# Altium schematic sheet MainSchematic.2.SchDoc
size OrCAD B; SheetNumber: 1; SheetTotal: 3
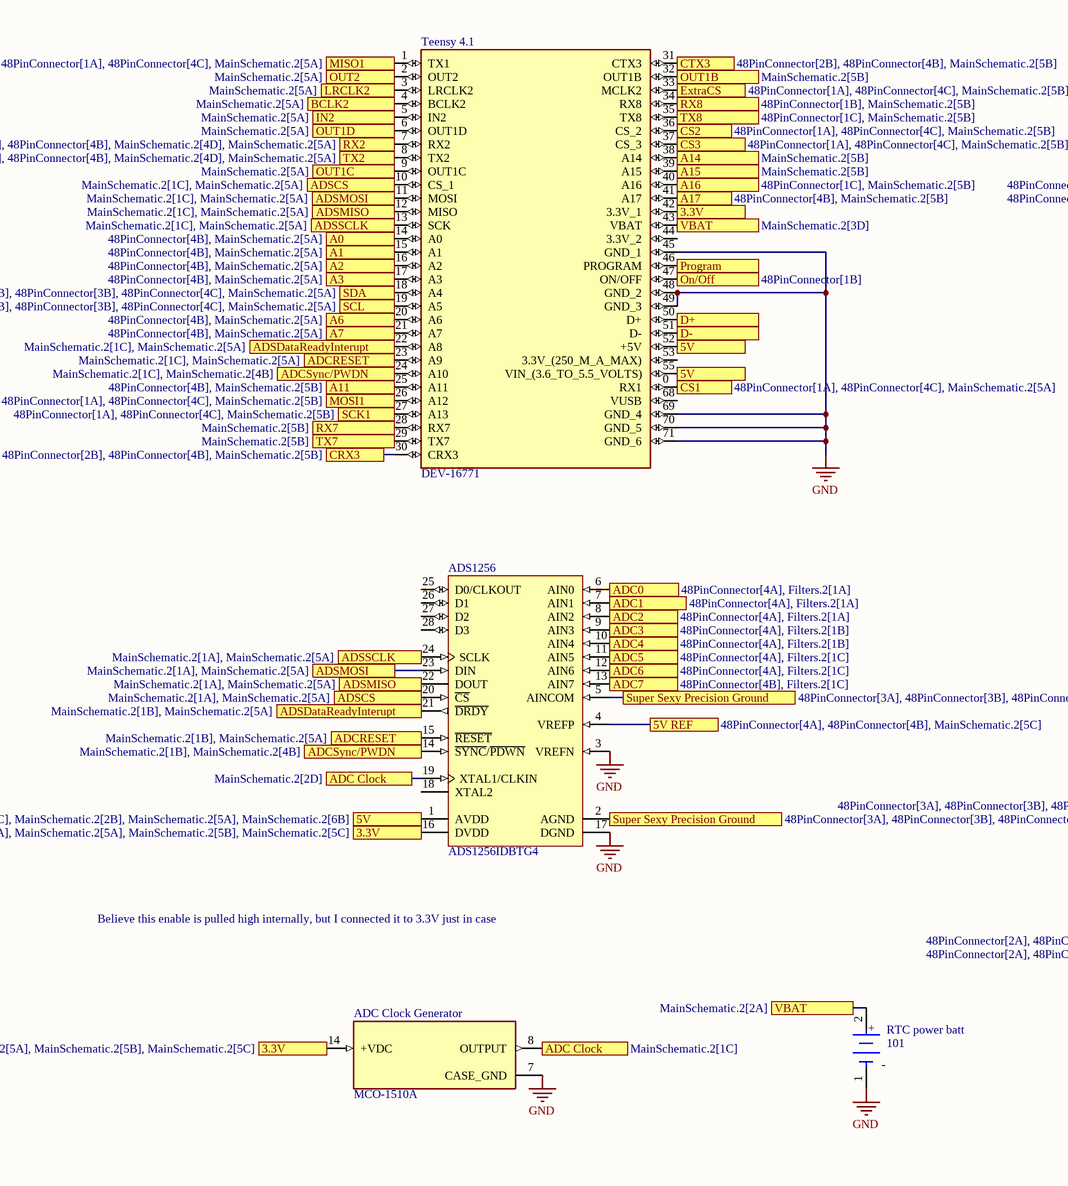
[diagram p0: MainSchematic.2.SchDoc, left]
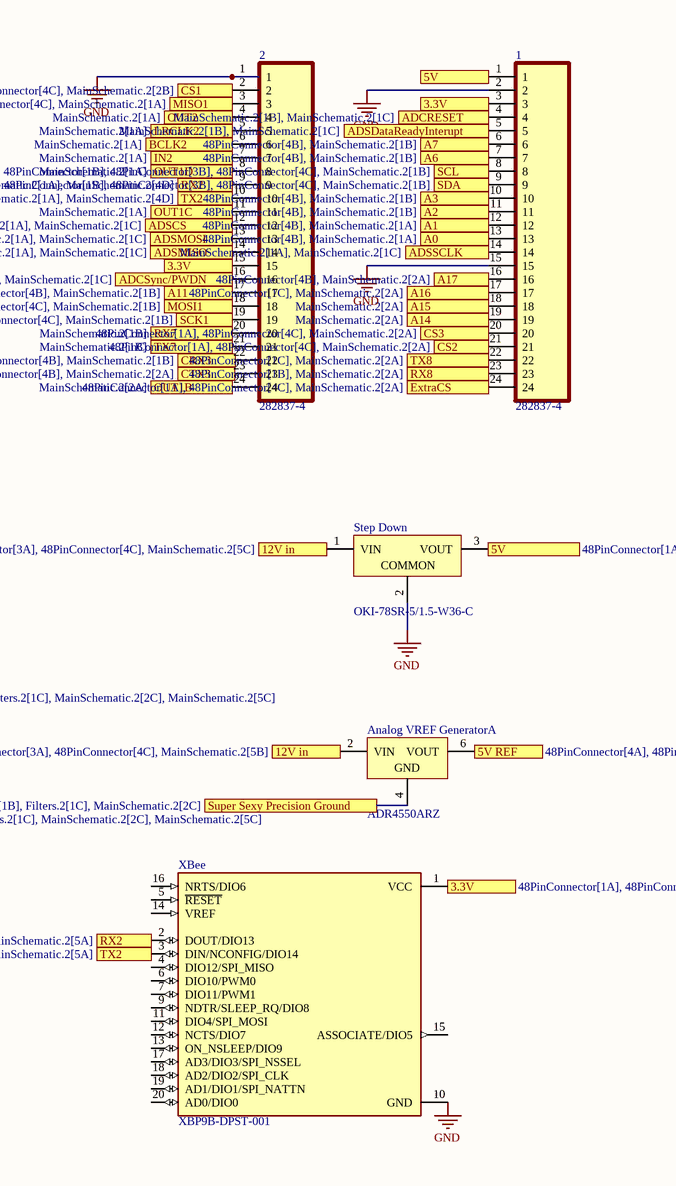
[diagram p1: MainSchematic.2.SchDoc, right]

## Parts
1  282837-4  [TE_282837-4]
2  282837-4  [TE_282837-4]
ADC_Clock_Generator  MCO-1510A  [OSC_ECS-100AX-500]
ADS1256  ADS1256IDBTG4  [TI-DB28_L]
Analog_VREF_Generator  ADR4550ARZ  [ADI-R-8_N]  (part A of 2)
RTC_power_batt  101  [FP-101-MFG]
Step_Down  OKI-78SR-5/1.5-W36-C  [MURA-OKI-78SR-3]
Teensy_4.1  DEV-16771  [MODULE_DEV-16771]
XBee  XBP9B-DPST-001  [DIP2200W51P200L3294H279Q20P]

## Ports
3.3V (see 48PinConnector[1A], 48PinConnector[2B], 48PinConnector[2D], 48PinConnector[4C], MainSchematic.2[1C], MainSchematic.2[1D], MainSchematic.2[2A], MainSchematic.2[5A], MainSchematic.2[5B]), 3.3V (see 48PinConnector[1A], 48PinConnector[2B], 48PinConnector[2D], 48PinConnector[4C], MainSchematic.2[1C], MainSchematic.2[1D], MainSchematic.2[2A], MainSchematic.2[5A], MainSchematic.2[5C]), 3.3V (see 48PinConnector[1A], 48PinConnector[2B], 48PinConnector[2D], 48PinConnector[4C], MainSchematic.2[1C], MainSchematic.2[1D], MainSchematic.2[2A], MainSchematic.2[5B], MainSchematic.2[5C]), 3.3V (see 48PinConnector[1A], 48PinConnector[2B], 48PinConnector[2D], 48PinConnector[4C], MainSchematic.2[1C], MainSchematic.2[1D], MainSchematic.2[5A], MainSchematic.2[5B], MainSchematic.2[5C]), 3.3V (see 48PinConnector[1A], 48PinConnector[2B], 48PinConnector[2D], 48PinConnector[4C], MainSchematic.2[1C], MainSchematic.2[2A], MainSchematic.2[5A], MainSchematic.2[5B], MainSchematic.2[5C]), 3.3V (see 48PinConnector[1A], 48PinConnector[2B], 48PinConnector[2D], 48PinConnector[4C], MainSchematic.2[1D], MainSchematic.2[2A], MainSchematic.2[5A], MainSchematic.2[5B], MainSchematic.2[5C]), 5V (see 48PinConnector[1A], 48PinConnector[1B], 48PinConnector[1D], 48PinConnector[2A], 48PinConnector[3B], 48PinConnector[4B], 48PinConnector[4C], MainSchematic.2[1C], MainSchematic.2[2B], MainSchematic.2[5A]), 5V (see 48PinConnector[1A], 48PinConnector[1B], 48PinConnector[1D], 48PinConnector[2A], 48PinConnector[3B], 48PinConnector[4B], 48PinConnector[4C], MainSchematic.2[1C], MainSchematic.2[2B], MainSchematic.2[5A], MainSchematic.2[6B]), 5V (see 48PinConnector[1A], 48PinConnector[1B], 48PinConnector[1D], 48PinConnector[2A], 48PinConnector[3B], 48PinConnector[4B], 48PinConnector[4C], MainSchematic.2[1C], MainSchematic.2[2B], MainSchematic.2[6B]), 5V (see 48PinConnector[1A], 48PinConnector[1B], 48PinConnector[1D], 48PinConnector[2A], 48PinConnector[3B], 48PinConnector[4B], 48PinConnector[4C], MainSchematic.2[2B], MainSchematic.2[5A], MainSchematic.2[6B]), 5V REF (see 48PinConnector[4A], 48PinConnector[4B], MainSchematic.2[2C]), 5V REF (see 48PinConnector[4A], 48PinConnector[4B], MainSchematic.2[5C]), 12V in (see 48PinConnector[2D], 48PinConnector[3A], 48PinConnector[4C], MainSchematic.2[5B]), 12V in (see 48PinConnector[2D], 48PinConnector[3A], 48PinConnector[4C], MainSchematic.2[5C]), A0 (see 48PinConnector[4B], MainSchematic.2[1A]), A0 (see 48PinConnector[4B], MainSchematic.2[5A]), A1 (see 48PinConnector[4B], MainSchematic.2[1A]), A1 (see 48PinConnector[4B], MainSchematic.2[5A]), A2 (see 48PinConnector[4B], MainSchematic.2[1B]), A2 (see 48PinConnector[4B], MainSchematic.2[5A]), A3 (see 48PinConnector[4B], MainSchematic.2[1B]), A3 (see 48PinConnector[4B], MainSchematic.2[5A]), A6 (see 48PinConnector[4B], MainSchematic.2[1B]), A6 (see 48PinConnector[4B], MainSchematic.2[5A]), A7 (see 48PinConnector[4B], MainSchematic.2[1B]), A7 (see 48PinConnector[4B], MainSchematic.2[5A]), A11 (see 48PinConnector[4B], MainSchematic.2[1B]), A11 (see 48PinConnector[4B], MainSchematic.2[5B]), A14 (see MainSchematic.2[2A]), A14 (see MainSchematic.2[5B]), A15 (see MainSchematic.2[2A]), A15 (see MainSchematic.2[5B]), A16 (see 48PinConnector[1C], MainSchematic.2[2A]), A16 (see 48PinConnector[1C], MainSchematic.2[5B]), A17 (see 48PinConnector[4B], MainSchematic.2[2A]), A17 (see 48PinConnector[4B], MainSchematic.2[5B]), ADC0 (see 48PinConnector[4A], Filters.2[1A]), ADC1 (see 48PinConnector[4A], Filters.2[1A]), ADC2 (see 48PinConnector[4A], Filters.2[1A]), ADC3 (see 48PinConnector[4A], Filters.2[1B]), ADC4 (see 48PinConnector[4A], Filters.2[1B]), ADC5 (see 48PinConnector[4A], Filters.2[1C]), ADC6 (see 48PinConnector[4A], Filters.2[1C]), ADC7 (see 48PinConnector[4B], Filters.2[1C]), ADC Clock (see MainSchematic.2[1C]), ADC Clock (see MainSchematic.2[2D]), ADCRESET (see MainSchematic.2[1B], MainSchematic.2[1C]), ADCRESET (see MainSchematic.2[1B], MainSchematic.2[5A]), ADCRESET (see MainSchematic.2[1C], MainSchematic.2[5A]), ADCSync/PWDN (see MainSchematic.2[1B], MainSchematic.2[1C]), ADCSync/PWDN (see MainSchematic.2[1B], MainSchematic.2[4B]), ADCSync/PWDN (see MainSchematic.2[1C], MainSchematic.2[4B]), ADSCS (see MainSchematic.2[1A], MainSchematic.2[1C]), ADSCS (see MainSchematic.2[1A], MainSchematic.2[5A]), ADSCS (see MainSchematic.2[1C], MainSchematic.2[5A]), ADSDataReadyInterupt (see MainSchematic.2[1B], MainSchematic.2[1C]), ADSDataReadyInterupt (see MainSchematic.2[1B], MainSchematic.2[5A]), ADSDataReadyInterupt (see MainSchematic.2[1C], MainSchematic.2[5A]), ADSMISO (see MainSchematic.2[1A], MainSchematic.2[1C]), ADSMISO (see MainSchematic.2[1A], MainSchematic.2[5A]), ADSMISO (see MainSchematic.2[1C], MainSchematic.2[5A]), ADSMOSI (see MainSchematic.2[1A], MainSchematic.2[1C]), ADSMOSI (see MainSchematic.2[1A], MainSchematic.2[5A]), ADSMOSI (see MainSchematic.2[1C], MainSchematic.2[5A]), ADSSCLK (see MainSchematic.2[1A], MainSchematic.2[1C]), ADSSCLK (see MainSchematic.2[1A], MainSchematic.2[5A]), ADSSCLK (see MainSchematic.2[1C], MainSchematic.2[5A]), BCLK2 (see MainSchematic.2[1A]), BCLK2 (see MainSchematic.2[5A]), CRX3 (see 48PinConnector[2B], 48PinConnector[4B], MainSchematic.2[1B]), CRX3 (see 48PinConnector[2B], 48PinConnector[4B], MainSchematic.2[5B]), CS1 (see 48PinConnector[1A], 48PinConnector[4C], MainSchematic.2[2B]), CS1 (see 48PinConnector[1A], 48PinConnector[4C], MainSchematic.2[5A]), CS2 (see 48PinConnector[1A], 48PinConnector[4C], MainSchematic.2[2A]), CS2 (see 48PinConnector[1A], 48PinConnector[4C], MainSchematic.2[5B]), CS3 (see 48PinConnector[1A], 48PinConnector[4C], MainSchematic.2[2A]), CS3 (see 48PinConnector[1A], 48PinConnector[4C], MainSchematic.2[5B]), CTX3 (see 48PinConnector[2B], 48PinConnector[4B], MainSchematic.2[2A]), CTX3 (see 48PinConnector[2B], 48PinConnector[4B], MainSchematic.2[5B]), D+, D-, ExtraCS (see 48PinConnector[1A], 48PinConnector[4C], MainSchematic.2[2A]), ExtraCS (see 48PinConnector[1A], 48PinConnector[4C], MainSchematic.2[5B]), IN2 (see MainSchematic.2[1A]), IN2 (see MainSchematic.2[5A]), LRCLK2 (see MainSchematic.2[1A]), LRCLK2 (see MainSchematic.2[5A]), MISO1 (see 48PinConnector[1A], 48PinConnector[4C], MainSchematic.2[1A]), MISO1 (see 48PinConnector[1A], 48PinConnector[4C], MainSchematic.2[5A]), MOSI1 (see 48PinConnector[1A], 48PinConnector[4C], MainSchematic.2[1B]), MOSI1 (see 48PinConnector[1A], 48PinConnector[4C], MainSchematic.2[5B]), On/Off (see 48PinConnector[1B]), OUT1B (see MainSchematic.2[2A]), OUT1B (see MainSchematic.2[5B]), OUT1C (see MainSchematic.2[1A]), OUT1C (see MainSchematic.2[5A]), OUT1D (see MainSchematic.2[1A]), OUT1D (see MainSchematic.2[5A]), OUT2 (see MainSchematic.2[1A]), OUT2 (see MainSchematic.2[5A]), Program, RX2 (see 48PinConnector[2A], 48PinConnector[4B], MainSchematic.2[1A], MainSchematic.2[4D]), RX2 (see 48PinConnector[2A], 48PinConnector[4B], MainSchematic.2[1A], MainSchematic.2[5A]), RX2 (see 48PinConnector[2A], 48PinConnector[4B], MainSchematic.2[4D], MainSchematic.2[5A]), RX7 (see MainSchematic.2[1B]), RX7 (see MainSchematic.2[5B]), RX8 (see 48PinConnector[1B], MainSchematic.2[2A]), RX8 (see 48PinConnector[1B], MainSchematic.2[5B]), SCK1 (see 48PinConnector[1A], 48PinConnector[4C], MainSchematic.2[1B]), SCK1 (see 48PinConnector[1A], 48PinConnector[4C], MainSchematic.2[5B]), SCL (see 48PinConnector[1B], 48PinConnector[3B], 48PinConnector[4C], MainSchematic.2[1B]), SCL (see 48PinConnector[1B], 48PinConnector[3B], 48PinConnector[4C], MainSchematic.2[5A]), SDA (see 48PinConnector[1B], 48PinConnector[3B], 48PinConnector[4C], MainSchematic.2[1B]), SDA (see 48PinConnector[1B], 48PinConnector[3B], 48PinConnector[4C], MainSchematic.2[5A]), Super Sexy Precision Ground (see 48PinConnector[3A], 48PinConnector[3B], 48PinConnector[3C], Filters.2[1A], Filters.2[1B], Filters.2[1C], MainSchematic.2[2C]), Super Sexy Precision Ground (see 48PinConnector[3A], 48PinConnector[3B], 48PinConnector[3C], Filters.2[1A], Filters.2[1B], Filters.2[1C], MainSchematic.2[2C], MainSchematic.2[5C]), TX2 (see 48PinConnector[2A], 48PinConnector[4B], MainSchematic.2[1A], MainSchematic.2[4D]), TX2 (see 48PinConnector[2A], 48PinConnector[4B], MainSchematic.2[1A], MainSchematic.2[5A]), TX2 (see 48PinConnector[2A], 48PinConnector[4B], MainSchematic.2[4D], MainSchematic.2[5A]), TX7 (see MainSchematic.2[1B]), TX7 (see MainSchematic.2[5B]), TX8 (see 48PinConnector[1C], MainSchematic.2[2A]), TX8 (see 48PinConnector[1C], MainSchematic.2[5B]), VBAT (see MainSchematic.2[2A]), VBAT (see MainSchematic.2[3D])

## Nets
GND: 1.2 1.15 2.1 ADC_Clock_Generator.7(CASE_GND) ADS1256.3(VREFN) ADS1256.17(DGND) RTC_power_batt.1(C) Step_Down.2(COMMON) Teensy_4.1.45(GND_1) Teensy_4.1.48(GND_2) Teensy_4.1.49(GND_3) Teensy_4.1.69(GND_4) Teensy_4.1.70(GND_5) Teensy_4.1.71(GND_6) XBee.10(GND)
3.3V: 1.3 2.15 ADC_Clock_Generator.14(+VDC) ADS1256.16(DVDD) Teensy_4.1.42(3.3V_1) XBee.1(VCC) ; port 3.3V
5V: 1.1 ADS1256.1(AVDD) Step_Down.3(VOUT) Teensy_4.1.52(+5V) Teensy_4.1.55(VIN_(3.6_TO_5.5_VOLTS)) ; port 5V
5V REF: ADS1256.4(VREFP) Analog_VREF_Generator.6(VOUT) ; port 5V REF
12V in: Analog_VREF_Generator.2(VIN) Step_Down.1(VIN) ; port 12V in
A0: 1.13 Teensy_4.1.14(A0) ; port A0
A1: 1.12 Teensy_4.1.15(A1) ; port A1
A2: 1.11 Teensy_4.1.16(A2) ; port A2
A3: 1.10 Teensy_4.1.17(A3) ; port A3
A6: 1.7 Teensy_4.1.20(A6) ; port A6
A7: 1.6 Teensy_4.1.21(A7) ; port A7
A11: 2.17 Teensy_4.1.25(A11) ; port A11
A14: 1.19 Teensy_4.1.38(A14) ; port A14
A15: 1.18 Teensy_4.1.39(A15) ; port A15
A16: 1.17 Teensy_4.1.40(A16) ; port A16
A17: 1.16 Teensy_4.1.41(A17) ; port A17
ADC0: ADS1256.6(AIN0) ; port ADC0
ADC1: ADS1256.7(AIN1) ; port ADC1
ADC2: ADS1256.8(AIN2) ; port ADC2
ADC3: ADS1256.9(AIN3) ; port ADC3
ADC4: ADS1256.10(AIN4) ; port ADC4
ADC5: ADS1256.11(AIN5) ; port ADC5
ADC6: ADS1256.12(AIN6) ; port ADC6
ADC7: ADS1256.13(AIN7) ; port ADC7
ADC Clock: ADC_Clock_Generator.8(OUTPUT) ADS1256.19(XTAL1/CLKIN) ; port ADC Clock
ADCRESET: 1.4 ADS1256.15(~{RESET}) Teensy_4.1.23(A9) ; port ADCRESET
ADCSync/PWDN: 2.16 ADS1256.14(~{SYNC}/~{PDWN}) Teensy_4.1.24(A10) ; port ADCSync/PWDN
ADSCS: 2.12 ADS1256.20(~{CS}) Teensy_4.1.10(CS_1) ; port ADSCS
ADSDataReadyInterupt: 1.5 ADS1256.21(~{DRDY}) Teensy_4.1.22(A8) ; port ADSDataReadyInterupt
ADSMISO: 2.14 ADS1256.22(DOUT) Teensy_4.1.12(MISO) ; port ADSMISO
ADSMOSI: 2.13 ADS1256.23(DIN) Teensy_4.1.11(MOSI) ; port ADSMOSI
ADSSCLK: 1.14 ADS1256.24(SCLK) Teensy_4.1.13(SCK) ; port ADSSCLK
BCLK2: 2.6 Teensy_4.1.4(BCLK2) ; port BCLK2
CRX3: Teensy_4.1.30(CRX3) ; port CRX3
CS1: 2.2 Teensy_4.1.0(RX1) ; port CS1
CS2: 1.21 Teensy_4.1.36(CS_2) ; port CS2
CS3: 1.20 Teensy_4.1.37(CS_3) ; port CS3
CTX3: Teensy_4.1.31(CTX3) ; port CTX3
D+: Teensy_4.1.50(D+) ; port D+
D-: Teensy_4.1.51(D-) ; port D-
ExtraCS: 1.24 Teensy_4.1.33(MCLK2) ; port ExtraCS
IN2: 2.7 Teensy_4.1.5(IN2) ; port IN2
LRCLK2: 2.5 Teensy_4.1.3(LRCLK2) ; port LRCLK2
MISO1: 2.3 Teensy_4.1.1(TX1) ; port MISO1
MOSI1: 2.18 Teensy_4.1.26(A12) ; port MOSI1
On/Off: Teensy_4.1.47(ON/OFF) ; port On/Off
OUT1B: 2.24 Teensy_4.1.32(OUT1B) ; port OUT1B
OUT1C: 2.11 Teensy_4.1.9(OUT1C) ; port OUT1C
OUT1D: 2.8 Teensy_4.1.6(OUT1D) ; port OUT1D
OUT2: 2.4 Teensy_4.1.2(OUT2) ; port OUT2
Program: Teensy_4.1.46(PROGRAM) ; port Program
RX2: 2.9 Teensy_4.1.7(RX2) XBee.2(DOUT/DIO13) ; port RX2
RX7: 2.20 Teensy_4.1.28(RX7) ; port RX7
RX8: 1.23 Teensy_4.1.34(RX8) ; port RX8
SCK1: 2.19 Teensy_4.1.27(A13) ; port SCK1
SCL: 1.8 Teensy_4.1.19(A5) ; port SCL
SDA: 1.9 Teensy_4.1.18(A4) ; port SDA
Super Sexy Precision Ground: ADS1256.2(AGND) ADS1256.5(AINCOM) Analog_VREF_Generator.4(GND) ; port Super Sexy Precision Ground
TX2: 2.10 Teensy_4.1.8(TX2) XBee.3(DIN/NCONFIG/DIO14) ; port TX2
TX7: 2.21 Teensy_4.1.29(TX7) ; port TX7
TX8: 1.22 Teensy_4.1.35(TX8) ; port TX8
VBAT: RTC_power_batt.2(A) Teensy_4.1.43(VBAT) ; port VBAT

Not connected (* = marked no-connect by the designer): 2 22 23; ADS1256 18(XTAL2) 25(D0/CLKOUT) 26(D1) 27(D2) 28(D3); Teensy_4.1 44(3.3V_2) 53(3.3V_(250_M_A_MAX)) 68(VUSB); XBee 4(DIO12/SPI_MISO) 5(~{RESET}) 6(DIO10/PWM0) 7(DIO11/PWM1) 9(NDTR/SLEEP_RQ/DIO8) 11(DIO4/SPI_MOSI) 12(NCTS/DIO7) 13(ON_NSLEEP/DIO9) 14(VREF) 15(ASSOCIATE/DIO5) 16(NRTS/DIO6) 17(AD3/DIO3/SPI_NSSEL) 18(AD2/DIO2/SPI_CLK) 19(AD1/DIO1/SPI_NATTN) 20(AD0/DIO0)

## Notes on the sheet
- Believe this enable is pulled high internally, but I connected it to 3.3V just in case
- (in symbol CMP-19636-000018-1) +

## Library data of the parts
1 2 = 282837-4: 4 Position Wire to Board Terminal Block Horizontal with Board 0.200 (5.08mm) Through Hole; MF: TE Connectivity; Value: *; SnapEDA_Link: https://www.snapeda.com/parts/282837-4/TE+Connectivity+AMP+Connectors/view-part/?ref=snap; Purchase-URL: https://pricing.snapeda.com/search/part/282837-4/?ref=eda; EU_RoHS_Compliance: Compliant with Exemptions; Availability: In Stock; Price: None; Package: None; Check_prices: https://www.snapeda.com/parts/282837-4/TE+Connectivity+AMP+Connectors/view-part/?ref=eda; MP: 282837-4
ADC_Clock_Generator = ECS-100AX-500: Oscillator  14-DIP, 4 Leads (Full Size, Metal Can); Package: None; Price: None; Value: *; MP: ECS-100AX-500; Availability: Unavailable
ADS1256 = CMP-0003-00153-1: 24-Bit, 30 kSPS Very Low Noise Delta-Sigma ADC with Multiplexer, -40 to 85 degC, 28-pin SOP (DB28), Green (RoHS & no Sb/Br); Manufacturer: Texas Instruments; SubFamily: Precision ADC (<=10MSPS); Analog Voltage AV/DD(Min)(V): 4.75; Digital Supply(Max)(V): 3.6; Digital Supply(Min)(V): 1.8; Resolution(Bits): 24; Analog Voltage AV/DD(Max)(V): 5.25; Sample Rate (max)(SPS): 30k; # Input Channels: 8; Interface: Serial SPI; Mounting Technology: Surface Mount; Architecture: Delta-Sigma; DatasheetVersion: SBAS288J; ComponentLink3Description: Package Specification; Eco-Plan: Green (RoHS & no Sb/Br); Code_JEDEC: MO-150; PackageDescription: 28-Pin Plastic Small Outline, Body 10.2 X 5.3 mm, Pitch 0.65 mm; ComponentLink3URL: http://www.ti.com/lit/ml/msso002e/msso002e.pdf; ComponentLink1Description: Manufacturer URL; ComponentLink1URL: http://www.ti.com/; PartNumber: ADS1256IDBTG4; ComponentLink2URL: http://www.ti.com/general/docs/lit/getliterature.tsp?genericPartNumber=ADS1256&fileType=pdf; PackageReference: DB28; PackageVersion: 4040065/E, 12/2001; ComponentLink2Description: Datasheet
Analog_VREF_Generator = CMP-0784-00194-1: Ultralow Noise, High Accuracy Voltage Reference, 5 V Output, 3 to 15 V Supply, Industrial, 8-pin SOIC (R-8), Tube; Manufacturer: Analog Devices; Vout: 5V; Max V Supply (V): 15; Min V Supply (V): 3; Ref Out TC (ppm/C): 4; PackageReference: R-8; PackageDescription: 8-Pin Standard Small Outline Package, Body 4.9 x 3.9 mm, Pitch 1.27 mm; PackageVersion: 060506-A, 06/2006; Operating Temp Range: -40 to 125 degC; DatasheetVersion: Rev. 0; ComponentLink1URL: http://www.analog.com/en/index.html; PartNumber: ADR4550ARZ; Mounting Technology: Surface Mount; ComponentLink2URL: http://www.analog.com/static/imported-files/data_sheets/ADR4520_4525_4530_4533_4540_4550.pdf; ComponentLink2Description: Datasheet; ComponentLink3Description: Package Specification; ComponentLink3URL: http://www.analog.com/static/imported-files/packages/PKG_PDF/SOIC_Narrow%20(R)/R_8.pdf; Packing: Tube; ComponentLink1Description: Manufacturer URL; Code_JEDEC: MS-012-AA; ComponentLink4Description: URL Link1; ComponentLink4URL: Product URL:http://www.analog.com/en/special-linear-functions/voltage-references/adr4550/products/product.html
RTC_power_batt = CMP-19636-000018-1: BATTERY HOLDER COIN 20MM PC PIN; Body Material: PBT; Number of Batteries: 1; Packaging: Bag; Lead Free: Lead Free; Package Quantity: 1; Contact Plating: Tin; Termination: PC Pin; REACH SVHC: No SVHC; Material: Steel; Mount: Through Hole; Max Operating Temperature: 145°C; Min Operating Temperature: -50°C; Number of Cells: 1; Series: -
Step_Down = CMP-2000-05274-1: Non-Isolated DC/DC Converter, 7.5 W, 7 to 36 V, 1.5 A, -40 to 85 degC, 3-Pin THD, RoHS; Manufacturer: Murata; Current - Output (Max): 1.5A; Power (Watts) - Max: 8W; Efficiency: 90.5%; Voltage - Input (Min): 7V; Voltage - Input (Max): 36V; Voltage - Output 1: 5V; Number of Outputs: 1; Package / Case: 3-SIPModule; Features: SCP; Type: LinearRegulatorReplacement; Size / Dimension: 0.41"Lx0.30"Wx0.65"H(10.4mmx7.6mmx16.5mm); Datasheet URL: https://datasheet.ciiva.com/8006/1790439-8006672.pdf; Datasheet Version: Oct-13; Power (Watts) - Manufacture Series: 8W; Voltage - Output 2: -; Series: Okami™OKI-78SR; Family: DCDCConverters; Manufacturer URL: http://www.murata.com/; Category: PowerSupplies-BoardMount; Voltage - Isolation: -; Packaging: Tube; Applications: ITE(Commercial); Mounting Type: ThroughHole; Voltage - Output 3: -; Operating Temperature: -40degC~85degC
Teensy_4.1 = CMP-003-000000-1: RT1062 Teensy 4.1 series ARM?Cortex?M7 MPU Embedded Evaluation Board; MF: SparkFun Electronics; SnapEDA_Link: https://www.snapeda.com/parts/DEV-16771/SparkFun+Electronics/view-part/?ref=snap; Package: None; Value: *; MP: DEV-16771; Check_prices: https://www.snapeda.com/parts/DEV-16771/SparkFun+Electronics/view-part/?ref=eda
XBee = XBP9B-DPST-001: General ISM < 1GHz - Transceiver Module 900MHz Antenna Not Included, RP-SMA Through Hole; MF: Digi International; SnapEDA_Link: https://www.snapeda.com/parts/XBP9B-DPST-001/Digi+International/view-part/?ref=snap; Package: Module Digi International; Value: *; MP: XBP9B-DPST-001; Check_prices: https://www.snapeda.com/parts/XBP9B-DPST-001/Digi+International/view-part/?ref=eda